# Altium schematic sheet SCH_07_Filter.SchDoc
size A4; SheetNumber: 12; SheetTotal: 14; SPICEModelCacheEHPMWYPG: <root> / <DocumentId>EHPMWYPG</DocumentId> / <CacheFrame Number="0"> / <Model Name="0603_885012206095_100nf" Kind="CKT"> / <Text>******* / .subckt 0603_885012206095_100nF 1 2 / Rser 1 3 0.0157659152881 / Lser 2 4 3.10171966E-10 / C1 3 4 0.0000001 / Rpar 3 4 5000000000 / .ends 0603_885012206095_100nF</Text> / </Model> / <Model Name="0603_885012106031_10uf" Kind="CKT"> / <Text>******* / .subckt 0603_885012106031_10uF 1 2 / Rser 1 3 0.0105 / Lser 2 4 0.0000000008 / C1 3 4 0.00001 / Rpar 3 4 10000000 / .ends 0603_885012106031_10uF</Text> / </Model> / <Model Name="0603_885012106022_1uf" Kind="CKT"> / <Text>******* / .subckt 0603_885012106022_1uF 1 2 / Rser 1 3 0.00857861035867 / Lser 2 4 3.03497279E-10 / C1 3 4 0.000001 / Rpar 3 4 500000000 / .ends 0603_885012106022_1uF</Text> / </Model> / <Model Name="0603_885012206046_100nf" Kind="CKT"> / <Text>******* / .subckt 0603_885012206046_100nF 1 2 / Rser 1 3 0.0189313024822 / Lser 2 4 4.50736859E-10 / C1 3 4 0.0000001 / Rpar 3 4 5000000000 / .ends 0603_885012206046_100nF</Text> / </Model> / </CacheFrame> / </root>
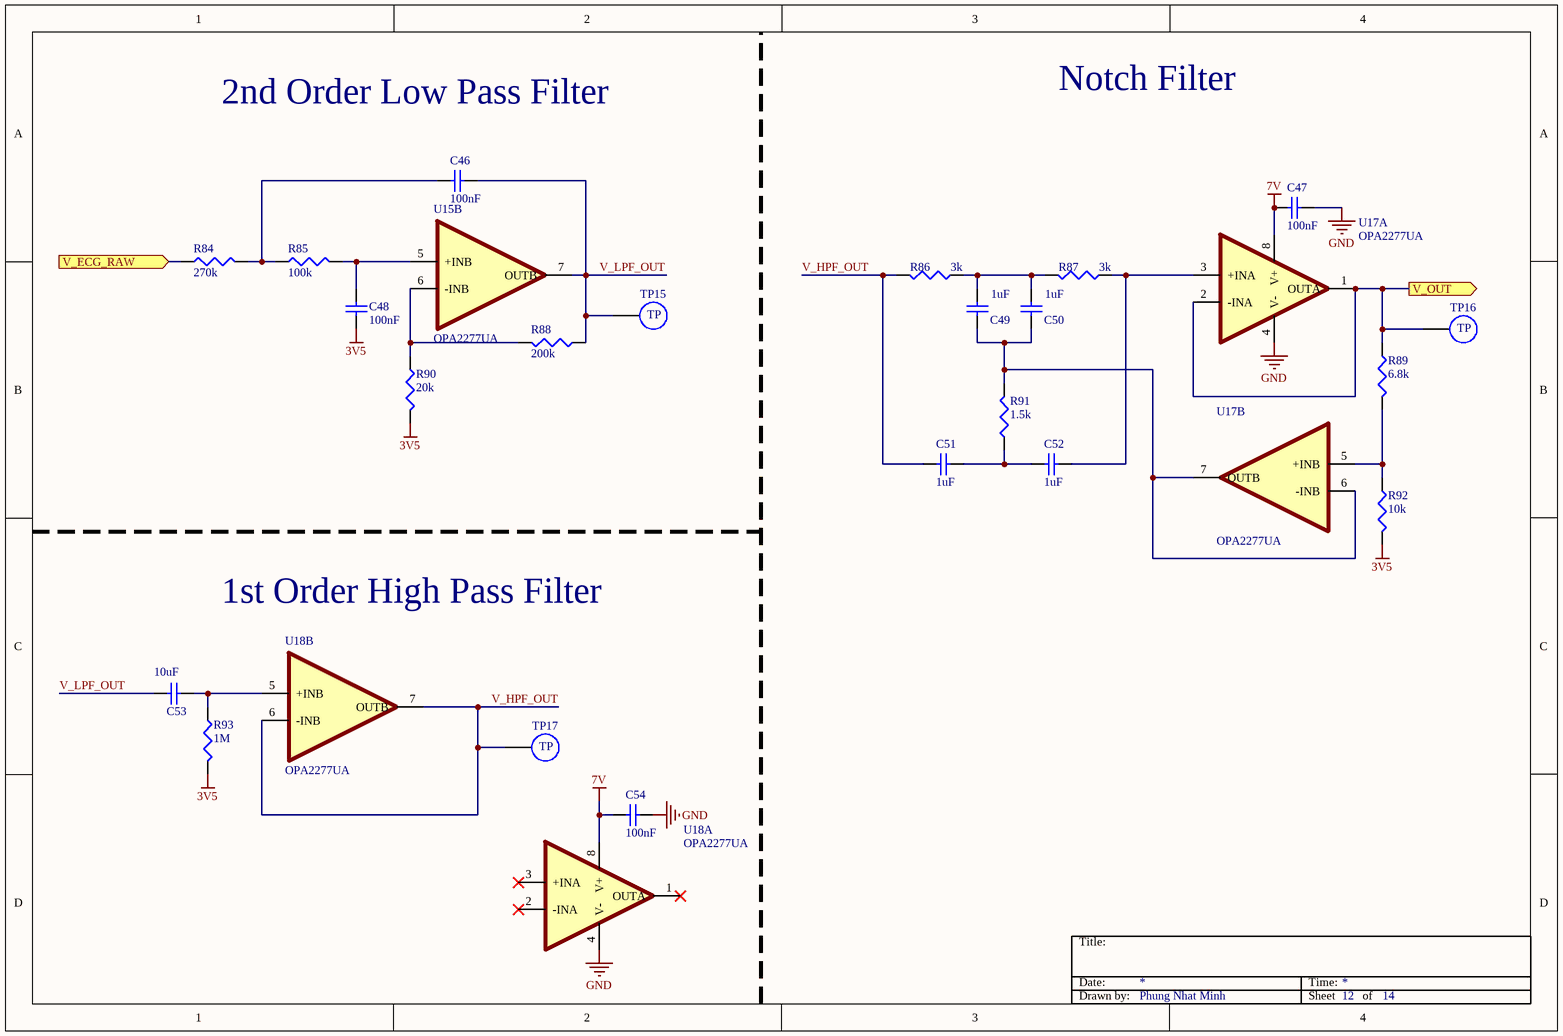
[diagram p0: SCH_07_Filter.SchDoc]

## Parts
C46  100nF  [WCAP-CSGP_0603_L1.6W0.8H0.8_Reflow]
C47  100nF  [WCAP-CSGP_0603_L1.6W0.8H0.8_Reflow]
C48  100nF  [WCAP-CSGP_0603_L1.6W0.8H0.8_Reflow]
C49  1uF  [WCAP-CSGP_0603_L1.6W0.8H0.8_Reflow]
C50  1uF  [WCAP-CSGP_0603_L1.6W0.8H0.8_Reflow]
C51  1uF  [WCAP-CSGP_0603_L1.6W0.8H0.8_Reflow]
C52  1uF  [WCAP-CSGP_0603_L1.6W0.8H0.8_Reflow]
C53  10uF  [WCAP-CSGP_0603_L1.6W0.8H0.8_Reflow]
C54  100nF  [WCAP-CSGP_0603_L1.6W0.8H0.8_Reflow]
R84  270k  [WRIS-PSMB_0603_L1.6W0.8H0.35]
R85  100k  [WRIS-PSMB_0603_L1.6W0.8H0.35]
R86  3k  [WRIS-PSMB_0603_L1.6W0.8H0.35]
R87  3k  [WRIS-PSMB_0603_L1.6W0.8H0.35]
R88  200k  [WRIS-PSMB_0603_L1.6W0.8H0.35]
R89  6.8k  [WRIS-PSMB_0603_L1.6W0.8H0.35]
R90  20k  [WRIS-PSMB_0603_L1.6W0.8H0.35]
R91  1.5k  [WRIS-PSMB_0603_L1.6W0.8H0.35]
R92  10k  [WRIS-PSMB_0603_L1.6W0.8H0.35]
R93  1M  [WRIS-PSMB_0603_L1.6W0.8H0.35]
TP15  Pad_Test_Point  [Pad_Test_Point]  (value not drawn)
TP16  Pad_Test_Point  [Pad_Test_Point]  (value not drawn)
TP17  Pad_Test_Point  [Pad_Test_Point]  (value not drawn)
U15  OPA2277UA  [SOIC127P599X175-8N]  (part B of 2)
U17  OPA2277UA  [SOIC127P599X175-8N]  (parts A,B of 2)
U18  OPA2277UA  [SOIC127P599X175-8N]  (parts A,B of 2)

## Ports
V_ECG_RAW (in, see Schematic_Top[3A], SCH_06_Analog_Mux[4B]), V_OUT (out, see Schematic_Top[3B], SCH_08_ADC[2B])

## Nets
3V5: C48.1 R90.2 R92.2 R93.2
7V: C47.2 C54.2 U17.8(V+) U18.8(V+)
GND: C47.1 C54.1 U17.4(V-) U18.4(V-)
V_ECG_RAW: R84.1 ; port V_ECG_RAW
V_HPF_OUT: C51.2 R86.2 TP17.1 U18.6(-INB) U18.7(OUTB)
V_LPF_OUT: C46.1 C53.1 R88.1 TP15.1 U15.7(OUTB)
V_OUT: R89.1 TP16.1 U17.1(OUTA) U17.2(-INA) ; port V_OUT
NetC46_2: C46.2 R84.2 R85.1
NetC48_2: C48.2 R85.2 U15.5(+INB)
NetC49_1: C49.1 C50.1 R91.2 U17.6(-INB) U17.7(OUTB)
NetC49_2: C49.2 C50.2 R86.1 R87.2
NetC51_1: C51.1 C52.2 R91.1
NetC52_1: C52.1 R87.1 U17.3(+INA)
NetC53_2: C53.2 R93.1 U18.5(+INB)
NetR88_2: R88.2 R90.1 U15.6(-INB)
NetR89_2: R89.2 R92.1 U17.5(+INB)

Not connected (* = marked no-connect by the designer): U18 1(OUTA)* 2(-INA)* 3(+INA)*

## Notes on the sheet
- 2nd Order Low Pass Filter
- Notch Filter
- 1st Order High Pass Filter
- Title:
- Date:
- Time:
- Drawn by:
- Phung Nhat Minh
- Sheet
- of
- (in symbol Pad_Test_Point) TP

## Library data of the parts
C46 C48 C54 = 885012206095: WCAP-CSGP Multilayer Ceramic Chip Capacitor, General Purpose, size 0603, X7R, 100nF, 50VDC; Manufacturer: Wurth Elektronik; Case/Size Code: 0603; Capacitance Tolerance: +/-10%; Dissipation Factor: 3%; Insulation Resistance: 5GOhm; Rated Voltage (DC): 50V; Technical Reference: X7R0603104K050DFCT10000; Manufacturer Part Number: 885012206095; Category: Multilayer Ceramic Chip Capacitors; Match Code: WCAP-CSGP; ComponentLink1Description: Website Link; ComponentLink1URL: https://www.we-online.com/redexpert/article/885012206095?ad; ComponentLink2Description: Datasheet Link; ComponentLink2URL: https://www.we-online.com/redexpert/spec/885012206095?ad; Mount: Surface Mount; Operating Temperature Max: 125°C; Operating Temperature Min: -55°C; Packaging: Tape and Reel; Length: 1.6mm; Width: 0.8mm; Height: 0.8mm; Capacitance: 100nF; Ceramic Type: X7R
C47 = 885012206046: WCAP-CSGP Multilayer Ceramic Chip Capacitor, General Purpose, size 0603, X7R, 100nF, 16VDC; Manufacturer: Wurth Elektronik; Case/Size Code: 0603; Capacitance Tolerance: +/-10%; Dissipation Factor: 3.5%; Insulation Resistance: 5GOhm; Rated Voltage (DC): 16V; Technical Reference: X7R0603104K016DFCT10000; Manufacturer Part Number: 885012206046; Category: Multilayer Ceramic Chip Capacitors; Match Code: WCAP-CSGP; ComponentLink1Description: Website Link; ComponentLink1URL: https://www.we-online.com/redexpert/article/885012206046?ad; ComponentLink2Description: Datasheet Link; ComponentLink2URL: https://www.we-online.com/redexpert/spec/885012206046?ad; Mount: Surface Mount; Operating Temperature Max: 125°C; Operating Temperature Min: -55°C; Packaging: Tape and Reel; Length: 1.6mm; Width: 0.8mm; Height: 0.8mm; Capacitance: 100nF; Ceramic Type: X7R
C49-C52 = 885012106022: WCAP-CSGP Multilayer Ceramic Chip Capacitor, General Purpose, size 0603, X5R, 1uF, 25VDC; Manufacturer: Wurth Elektronik; Case/Size Code: 0603; Capacitance Tolerance: +/-20%; Dissipation Factor: 10%; Insulation Resistance: 0.5GOhm; Rated Voltage (DC): 25V; Technical Reference: X5R0603105M025DFCT10000; Manufacturer Part Number: 885012106022; Category: Multilayer Ceramic Chip Capacitors; Match Code: WCAP-CSGP; ComponentLink1Description: Website Link; ComponentLink1URL: https://www.we-online.com/redexpert/article/885012106022?ad; ComponentLink2Description: Datasheet Link; ComponentLink2URL: https://www.we-online.com/redexpert/spec/885012106022?ad; Mount: Surface Mount; Operating Temperature Max: 85°C; Operating Temperature Min: -55°C; Packaging: Tape and Reel; Length: 1.6mm; Width: 0.8mm; Height: 0.8mm; Capacitance: 1uF; Ceramic Type: X5R
C53 = 885012106031: WCAP-CSGP Multilayer Ceramic Chip Capacitor, General Purpose, size 0603, X5R, 10uF, 25VDC; Manufacturer: Wurth Elektronik; Case/Size Code: 0603; Capacitance Tolerance: +/20%; Dissipation Factor: 20%; Insulation Resistance: 0.01GOhm; Rated Voltage (DC): 25V; Technical Reference: X5R0603106M025DFCT10000; Manufacturer Part Number: 885012106031; Category: Multilayer Ceramic Chip Capacitors; Match Code: WCAP-CSGP; ComponentLink1Description: Website Link; ComponentLink1URL: https://www.we-online.com/redexpert/article/885012106031?ad; ComponentLink2Description: Datasheet Link; ComponentLink2URL: https://www.we-online.com/redexpert/spec/885012106031?ad; Mount: Surface Mount; Operating Temperature Max: 85°C; Operating Temperature Min: -55°C; Packaging: Tape and Reel; Length: 1.6mm; Width: 0.8mm; Height: 0.8mm; Capacitance: 10uF; Ceramic Type: X5R
R84-R93 = 580060716001: WRIS-PSMB Metal Plate Resistor, SMT, size 0603, 0.33W, 5mΩ, +/-1%; Manufacturer: Wurth Elektronik; Case/Size Code: 0603; Rated Current: 8.12A; Technical Reference: MB0603R005F103KAATP0000; Temperature Coefficient of Resistance: +/-100ppm/°C; Manufacturer Part Number: 580060716001; Category: Metal Plate Resistors; Match Code: WRIS-PSMB; ComponentLink1Description: Website Link; ComponentLink1URL: https://www.we-online.com/redexpert/article/580060716001?ad; ComponentLink2Description: Datasheet Link; ComponentLink2URL: https://www.we-online.com/redexpert/spec/580060716001?ad; Mount: Surface Mount; Operating Temperature Max: 155°C; Operating Temperature Min: -55°C; Packaging: Tape and Reel; Length: 1.6mm; Width: 0.8mm; Height: 0.35mm; Rated Power: 0.33W; Resistance: 5mΩ; Resistance Tolerance: +/-1%
U15 U17 U18 = OPA2277UA: MP: OPA2227UA; Package: None; Price: None; Value: *; Availability: Unavailable